# EAGLE design bbf-pots (EAGLE 5.09)
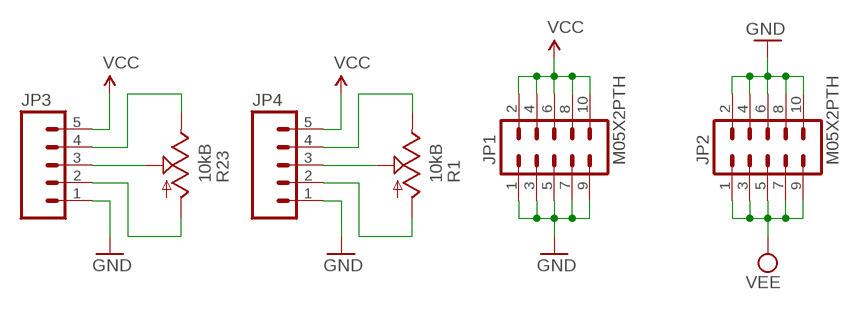
[diagram p0: schematic, sheet 1]

## Parts
JP1  M05X2PTH  [AVR_ICSP]
JP2  M05X2PTH  [AVR_ICSP]
JP3  M05PTH  [1X05]
JP4  M05PTH  [1X05]
R1  10kB  POT_USVERTICAL  [ALPS_POT_VERTICAL]
R23  10kB  POT_USVERTICAL  [ALPS_POT_VERTICAL]

## Nets
GND: JP1.1 JP1.3 JP1.5 JP1.7 JP1.9 JP2.2 JP2.4 JP2.6 JP2.8 JP2.10 JP3.1 JP4.1
N$2: JP3.4 R23.P$1(E)
N$3: JP3.3 R23.P$2(S)
N$4: JP3.2 R23.P$3(A)
N$5: JP4.4 R1.P$1(E)
N$6: JP4.3 R1.P$2(S)
N$7: JP4.2 R1.P$3(A)
VCC: JP1.2 JP1.4 JP1.6 JP1.8 JP1.10 JP3.5 JP4.5
VEE: JP2.1 JP2.3 JP2.5 JP2.7 JP2.9

## Library data of the parts
JP1 JP2 = SparkFun:M05X2: Header 5x2 Standard 10-pin dual row 0.1" header. Commonly used with AVR-ISP. Use with Spark Fun Electronics SKU: PRT-00778
JP3 JP4 = SparkFun:M05: Header 5 Standard 5-pin 0.1" header. Use with straight break away headers (SKU : PRT-00116), right angle break away headers (PRT-00553), swiss pins (PRT-00743), machine pins (PRT-00117), and female headers (PRT-00115). Molex polarized connector foot print use with SKU : PRT-08230 with associated crimp pins and housings.
R1 R23 = pot-alps:POT_US

## Board
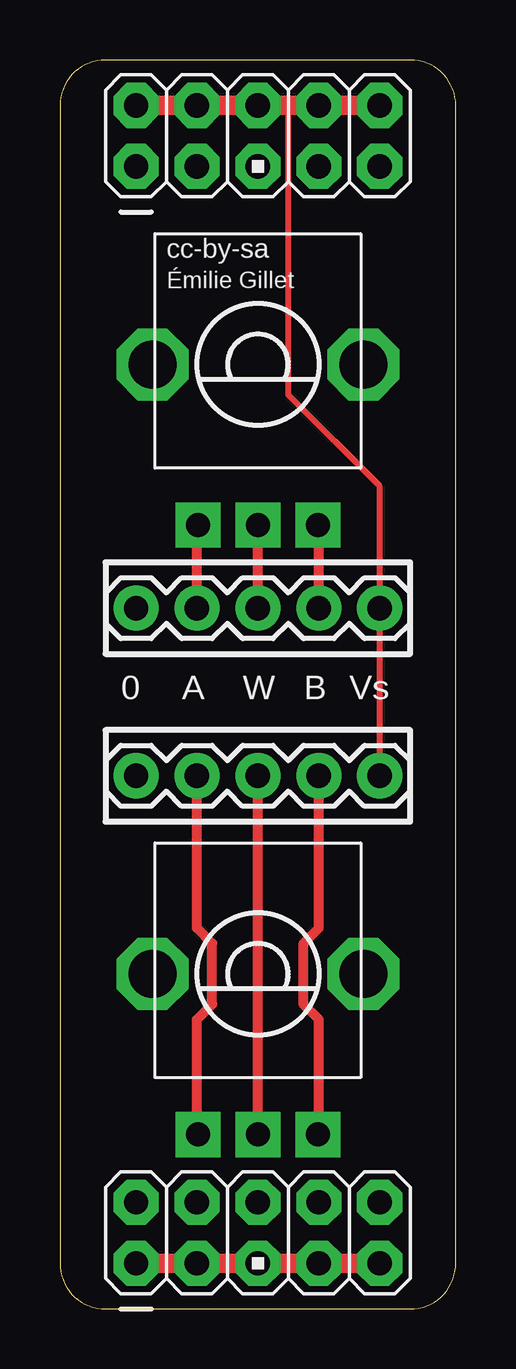
[diagram p1: board, top side]
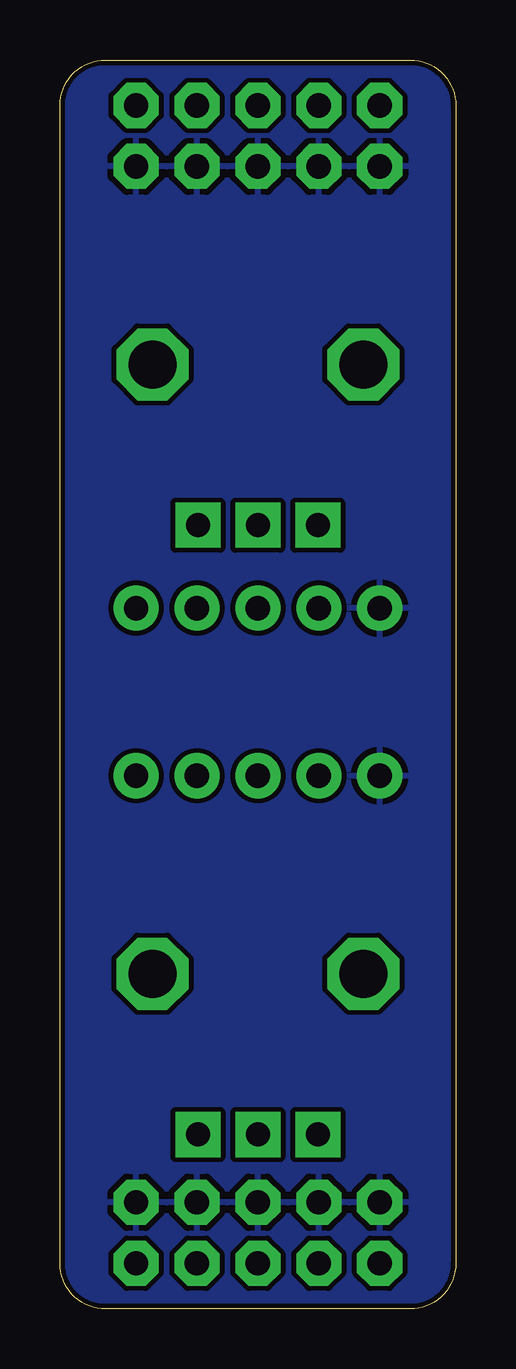
[diagram p2: board, bottom side, seen from below]

Size 16.51 x 52.06 mm. Coordinates in mm from the lower left corner, seen from the top.
Outline: 14.61,0 arc90 16.51,1.91 16.51,50.16 arc90 14.62,52.06 1.89,52.06 arc90 0,50.16 0,1.91 arc90 1.91,0 14.61,0
Copper layers (1*16): Top 0.035mm / dielectric 1.5mm / Bottom 0.035mm
Design rules "SparkFun_10mil *": minimum track width 8mil, minimum drill 20mil, track to track 8mil, track to pad 8mil, pad to pad 8mil, via to via 8mil, smd to smd 8mil, copper to edge 8mil, drill to drill 8mil, minimum pad ring 12mil, minimum via ring 10mil, stop-mask expansion 4mil, vias tented up to drill 25mil, thermal gap 10mil

### Footprints (pad centres in the part's own frame; a part is rotated, then mirrored left to right if it is on the bottom)
AVR_ICSP = drill 1.016 pad 1.88 octagon: 1 -1.27,5.08; 2 1.27,5.08; 3 -1.27,2.54; 4 1.27,2.54; 5 -1.27,0; 6 1.27,0; 7 -1.27,-2.54; 8 1.27,-2.54; 9 -1.27,-5.08; 10 1.27,-5.08
1X05 = drill 1.016 pad 1.88 round: 1 0,0; 2 2.54,0; 3 5.08,0; 4 7.62,0; 5 10.16,0
ALPS_POT_VERTICAL = drill 1 pad 1.88 square: P$1 -2.5,6.7; P$2 0,6.7; P$3 2.5,6.7 | drill 2 octagon: P$4 -4.4,0; P$5 4.4,0

### Placement (x,y rotation side)
JP1  8.26,48.9 90 top
JP2  8.26,3.18 90 top
JP3  3.18,29.21 0 top
JP4  3.18,22.23 0 top
R1  8.26,13.97 180 top
R23  8.26,39.37 180 top

### Tracks (layer width: path | path; a pad name or v marks a point on that pad's centre or on a via)
GND
  pour Bottom: 14.61,0 arc90 16.51,1.91 16.51,50.16 arc90 14.61,52.07 1.91,52.07 arc90 0,50.16 0,1.91 arc90 1.91,0
N$2
  Top 0.406: R23.P$1 10.79,32.63 JP3.4
N$3
  Top 0.406: JP3.3 R23.P$2
N$4
  Top 0.406: R23.P$3 5.71,32.63 JP3.2
N$5
  Top 0.406: R1.P$1 10.79,7.31 10.79,12.07 10.16,12.7 10.16,15.24 10.79,15.88 JP4.4
N$6
  Top 0.406: R1.P$2 JP4.3
N$7
  Top 0.406: R1.P$3 5.71,7.31 5.71,12.07 6.35,12.7 6.35,15.24 5.71,15.88 5.71,16.51 JP4.2
VCC
  Top 0.254: JP4.5 JP3.5 13.34,34.29 9.53,38.1 9.53,50.16
  Top 0.813: JP1.2 JP1.4 JP1.6 9.53,50.16 JP1.8 JP1.10
VEE
  Top 0.813: JP2.1 JP2.3 JP2.5 JP2.7 JP2.9

### Text on the board
tNames: cc-by-sa | Émilie Gillet | 0 | A | W | B | Vs